# EAGLE design pidshield-mk-2.1 (EAGLE 6.5.0)
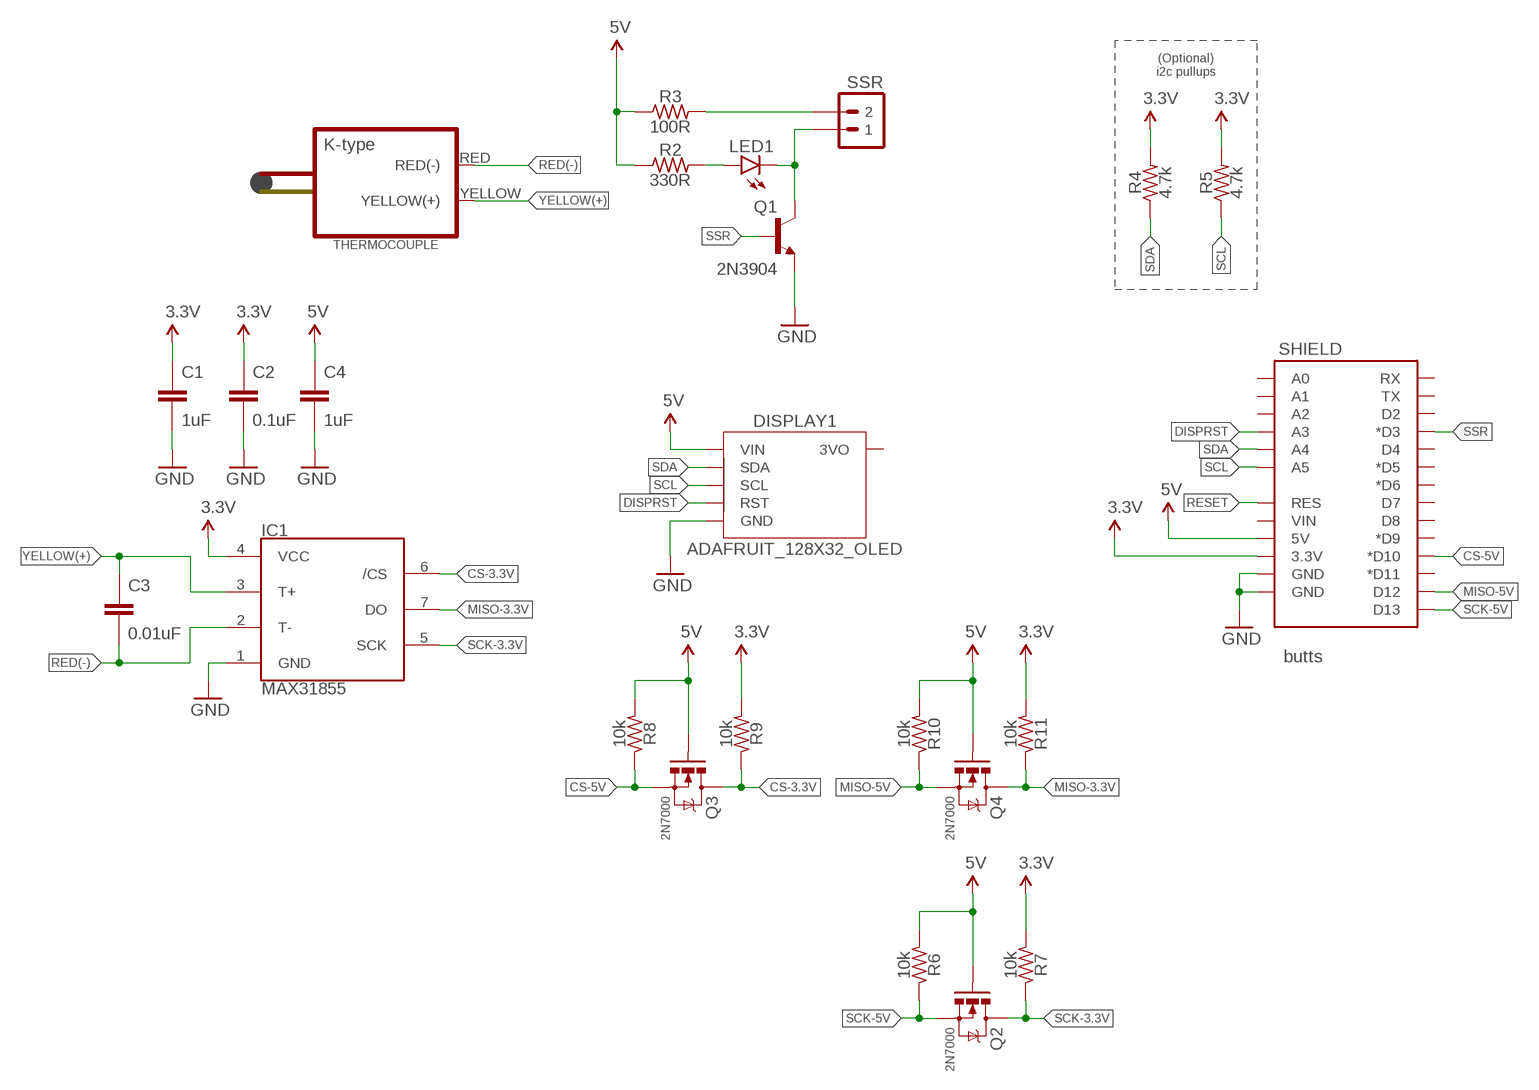
[diagram p0: schematic, sheet 1]

## Parts
C1  1uF  CAPACITOR-CERAMIC025-024X044  [C025-024X044]
C2  0.1uF  CAPACITOR-CERAMIC025-024X044  [C025-024X044]
C3  0.01uF  CAPACITOR-CERAMICC0805  [C0805]
C4  1uF  CAPACITOR-CERAMIC025-024X044  [C025-024X044]
DISPLAY1  ADAFRUIT_128X32_OLED  ADAFRUIT_128X32_OLED_I2CNOSILK_NOHOLES_NOPROBLEM  [ADAFRUIT_128X32_OLED_I2C_CLOSER_NS]
IC1  MAX31855  MAX31855SOIC  [SOIC127P600X175-8N]
LED1  LED3MM-LESS  [LED3MM-LESSSILK]
Q1  2N3904  TRANSISTOR_NPNTO-92-AMMO-EBC  [TO-92-AMMO]
Q2  2N7000  MOSFET-NCHANNEL2N7000-AMMO  [TO-92-AMMO]
Q3  2N7000  MOSFET-NCHANNEL2N7000-AMMO  [TO-92-AMMO]
Q4  2N7000  MOSFET-NCHANNEL2N7000-AMMO  [TO-92-AMMO]
R2  330R  RESISTORPTH-AXIAL-5.08MM  [RESISTOR-AXIAL-PTH-5.08MM]
R3  100R  RESISTORPTH-AXIAL-5.08MM  [RESISTOR-AXIAL-PTH-5.08MM]
R4  4.7k  RESISTORPTH-AXIAL-5.08MM  [RESISTOR-AXIAL-PTH-5.08MM]
R5  4.7k  RESISTORPTH-AXIAL-5.08MM  [RESISTOR-AXIAL-PTH-5.08MM]
R6  10k  RESISTORPTH-AXIAL-5.08MM  [RESISTOR-AXIAL-PTH-5.08MM]
R7  10k  RESISTORPTH-AXIAL-5.08MM  [RESISTOR-AXIAL-PTH-5.08MM]
R8  10k  RESISTORPTH-AXIAL-5.08MM  [RESISTOR-AXIAL-PTH-5.08MM]
R9  10k  RESISTORPTH-AXIAL-5.08MM  [RESISTOR-AXIAL-PTH-5.08MM]
R10  10k  RESISTORPTH-AXIAL-5.08MM  [RESISTOR-AXIAL-PTH-5.08MM]
R11  10k  RESISTORPTH-AXIAL-5.08MM  [RESISTOR-AXIAL-PTH-5.08MM]
SHIELD  butts  ARDUINO_SHIELD_SMALLER  [ARDUINO_SHIELD_NOOUTLINE_INSIDE_SMALLER]
SSR  M02JST-PTH-RA-SMALLPADS  [JST-2-PH-RA-PTH-SMALLPADS]
THERMOCOUPLE  THERMOCOUPLE-CONNECTORMINI-PCB  [PCC-SMP]

## Nets
3.3V: C1.1 C2.1 IC1.4(VCC) R4.P$2 R5.P$2 R7.P$2 R9.P$2 R11.P$2 SHIELD.3.3V
5V: C4.1 DISPLAY1.VIN Q2.2(G) Q3.2(G) Q4.2(G) R2.P$1 R3.P$1 R6.P$2 R8.P$2 R10.P$2 SHIELD.5V
CS-3.3V: IC1.6(/CS) Q3.3(D) R9.P$1
CS-5V: Q3.1(S) R8.P$1 SHIELD.D10(*D10)
DISPRST: DISPLAY1.RST SHIELD.A3
GND: C1.2 C2.2 C4.2 DISPLAY1.GND IC1.1(GND) Q1.1(E) SHIELD.GND@0(GND) SHIELD.GND@1(GND)
MISO-3.3V: IC1.7(DO) Q4.3(D) R11.P$1
MISO-5V: Q4.1(S) R10.P$1 SHIELD.D12
N$2: LED1.A R2.P$2
N$3: LED1.K(C) Q1.3(C) SSR.1
N$4: R3.P$2 SSR.2
RED(-): C3.2 IC1.2(T-) THERMOCOUPLE.RED(RED(-))
RESET: SHIELD.RES
SCK-3.3V: IC1.5(SCK) Q2.3(D) R7.P$1
SCK-5V: Q2.1(S) R6.P$1 SHIELD.D13
SCL: DISPLAY1.SCL R5.P$1 SHIELD.A5
SDA: DISPLAY1.SDA R4.P$1 SHIELD.A4
SSR: Q1.2(B) SHIELD.D3(*D3)
YELLOW(+): C3.1 IC1.3(T+) THERMOCOUPLE.YELLOW(YELLOW(+))
Unconnected: DISPLAY1.3VO SHIELD.A0 SHIELD.A1 SHIELD.A2 SHIELD.D2 SHIELD.D4 SHIELD.D5(*D5) SHIELD.D6(*D6) SHIELD.D7 SHIELD.D8 SHIELD.D9(*D9) SHIELD.D11(*D11) SHIELD.RX SHIELD.TX SHIELD.VIN

## Notes on the sheet
- (Optional)
  i2c pullups

## Library data of the parts
C1-C4 = A_butts:CAPACITOR-CERAMIC: CAPACITOR, European symbol
DISPLAY1 = A_butts:ADAFRUIT_128X32_OLED_I2C
IC1 = A_butts:MAX31855
LED1 = A_butts:LED: LEDs Standard schematic elements and footprints for 5mm, 3mm, 1206, and 0603 sized LEDs. 5mm - Spark Fun Electronics SKU : COM-00529 (and others)
Q1 = A_butts:TRANSISTOR_NPN: Generic NPN BJT MMBT2222A - TRANS-08049 (SOT-23, 1A 40V) MPSA42 - TRANS-09116 (SOT-23, 500mA 300V) MMBT5088LT1G - TRANS-11160 (SOT-23, 50 mA 30V) BC547 - COM-08928 <http://www.sparkfun.com/products/8928> (TO-92 45V 100mA) (1.Collector 2.Base 3.Emitter) 2N3904 - COM-00521 <http://www.sparkfun.com/products/521> (TO-92 40V 200mA) (1.Emitter 2.Base 3.Collector) P2N2222A - COM-12852 <http://www.sparkfun.com/products/12852> (TO-92 40V 600mA) (1.Collector 2.Base 3.Emitter)
Q2-Q4 = A_butts:MOSFET-NCHANNEL: Common NMOSFET Parts MFG P/N Store ID Prod ID FDD8780 TRANS-09984 SI7820DN TRANS-11055 FDS6630A IC-08089 2N7002PW TRANS-11151 FQP30N06L COM-10213 TRANS-10060 BSS123LT1G TRANS-08345 BSS138 TRANS-00830 BS170 2N7000
R2-R11 = A_butts:RESISTOR: RESISTOR, American symbol
SHIELD = A_butts:ARDUINO_SHIELD_SMALLER
SSR = A_butts:M02: Standard 2-pin 0.1" header. Use with - straight break away headers ( PRT-00116) - right angle break away headers (PRT-00553) - swiss pins (PRT-00743) - machine pins (PRT-00117) - female headers (PRT-00115) Molex polarized connector foot print use with: PRT-08233 with associated crimp pins and housings. 2.54_SCREWTERM for use with PRT-10571. 3.5mm Screw Terminal footprints for PRT-08084 5mm Screw Terminal footprints for use with PRT-08433
THERMOCOUPLE = A_butts:THERMOCOUPLE-CONNECTOR

## Board
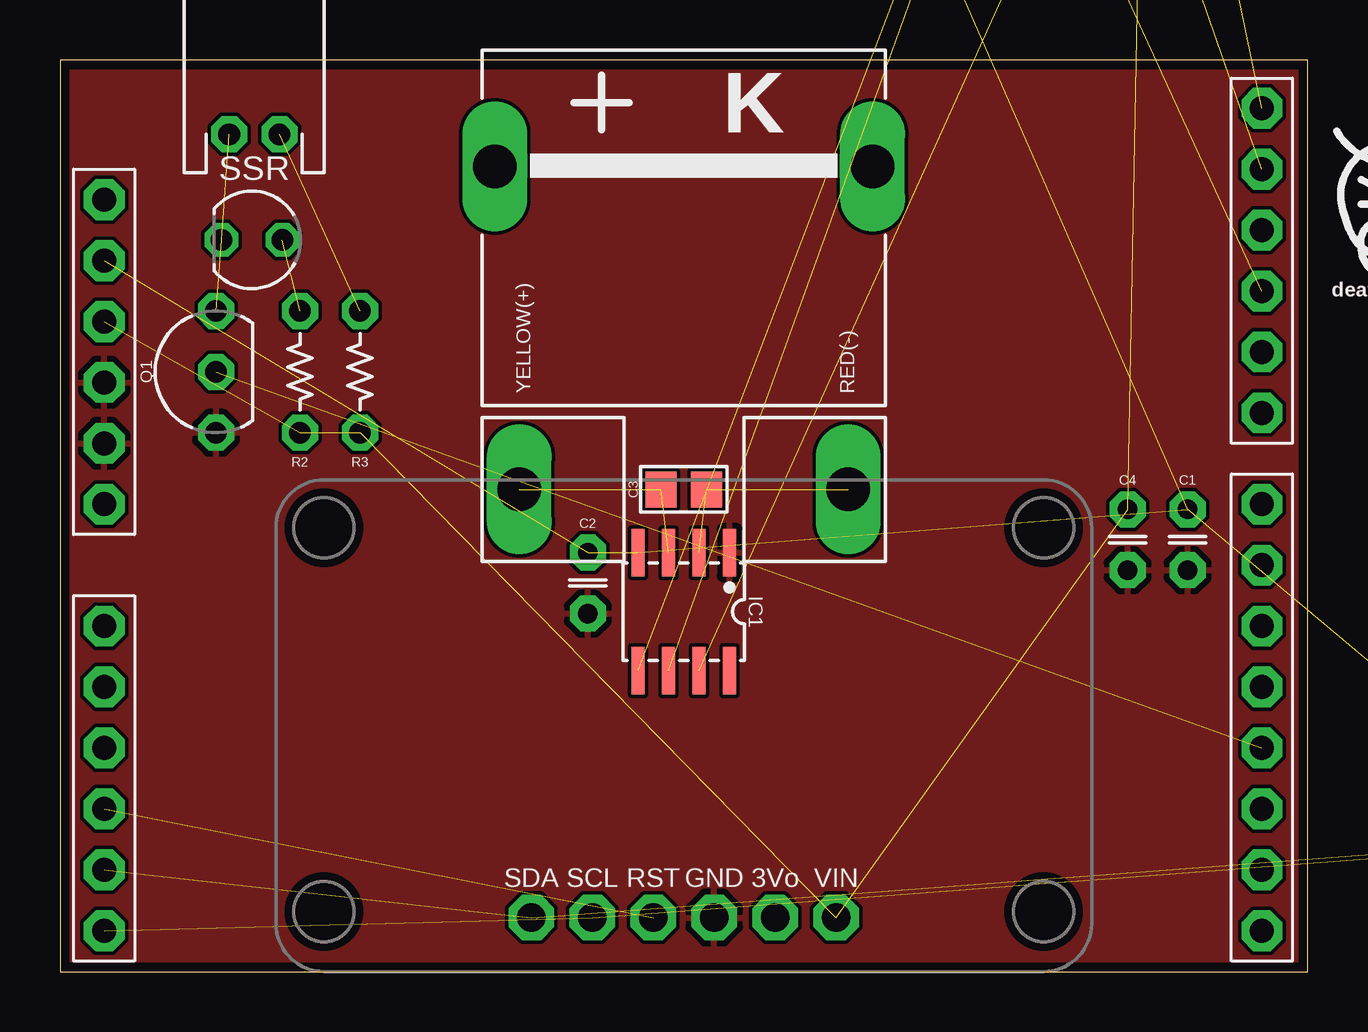
[diagram p1: board, top side]
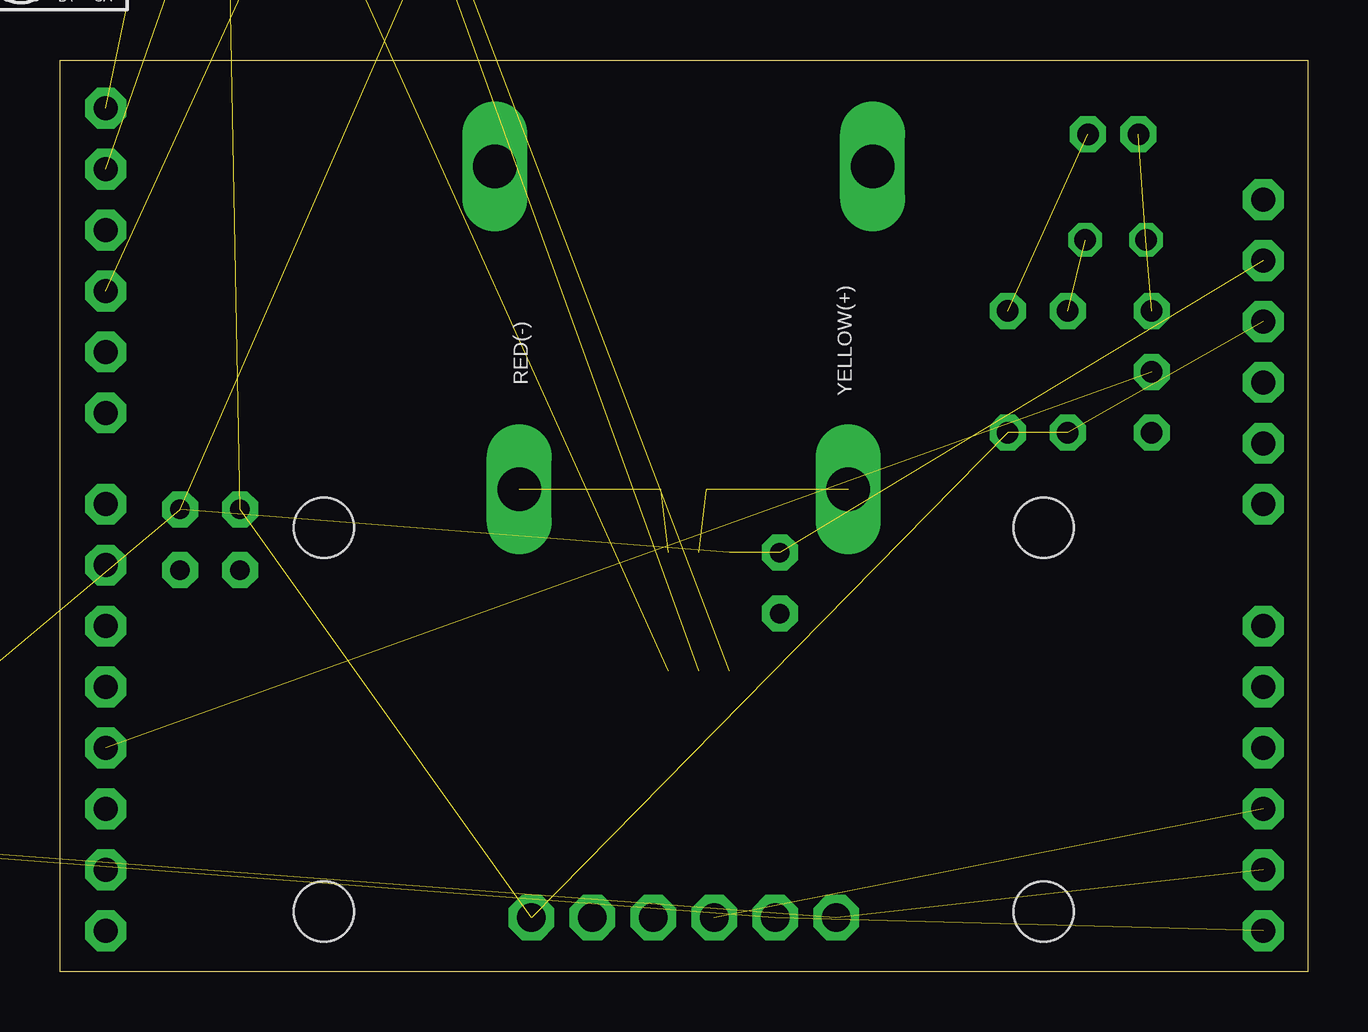
[diagram p2: board, bottom side, seen from below]

Size 52 x 38 mm. Coordinates in mm from the lower left corner, seen from the top.
Outline: 0,38 0,0 52,0 52,38 0,38
Copper layers (1*16): Top 0.0356mm / dielectric 1.5011mm / Bottom 0.0356mm
Design rules "LaenPCBOrder2": minimum track width 6mil, minimum drill 13mil, track to track 6mil, track to pad 6mil, pad to pad 6mil, via to via 6mil, smd to smd 6mil, copper to edge 15mil, drill to drill 6mil, minimum pad ring 7mil, minimum via ring 7mil, stop-mask expansion 3mil, vias tented up to drill 20mil, thermal gap 10mil
Holes 2.5 mm at 11,2.5 11,18.5 41,18.5 41,2.5

### Footprints (pad centres in the part's own frame; a part is rotated, then mirrored left to right if it is on the bottom)
C025-024X044 = drill 0.813 pad 1.5 octagon: 1 -1.27,0; 2 1.27,0
C0805 = smd 1.3 x 1.5: 1 -0.95,0; 2 0.95,0
ADAFRUIT_128X32_OLED_I2C_CLOSER_NS = drill 1.2 pad 1.9 octagon: 3VO 3.81,0; GND 1.27,0; RST -1.27,0; SCL -3.81,0; SDA -6.35,0; VIN 6.35,0
SOIC127P600X175-8N = smd 1.981 x 0.559: 1 -2.464,1.905; 2 -2.464,0.635; 3 -2.464,-0.635; 4 -2.464,-1.905; 5 2.464,-1.905; 6 2.464,-0.635; 7 2.464,0.635; 8 2.464,1.905
LED3MM-LESSSILK = drill 0.9 pad 1.4 octagon: A -1.27,0; K 1.27,0
TO-92-AMMO = drill 0.9 pad 1.5 octagon: 1 -2.54,0; 2 0,0; 3 2.54,0
RESISTOR-AXIAL-PTH-5.08MM = drill 0.9 pad 1.5 octagon: P$1 -2.54,0; P$2 2.54,0
ARDUINO_SHIELD_NOOUTLINE_INSIDE_SMALLER = drill 1 pad 1.7 octagon: 3.3V 48.26,-27.94; 5V 48.26,-25.4; A0 48.26,-12.7; A1 48.26,-10.16; A2 48.26,-7.62; A3 48.26,-5.08; A4 48.26,-2.54; A5 48.26,0; D2 0,-5.08; D3 0,-7.62; D4 0,-10.16; D5 0,-12.7; D6 0,-15.24; D7 0,-17.78; D8 0,-21.59; D9 0,-24.13; D10 0,-26.67; D11 0,-29.21; D12 0,-31.75; D13 0,-34.29; GND@0 48.26,-22.86; GND@1 48.26,-20.32; RES 48.26,-30.48; RX 0,0; TX 0,-2.54; VIN 48.26,-17.78
JST-2-PH-RA-PTH-SMALLPADS = drill 0.9 pad 1.5 octagon: 1 -1.05,0; 2 1.05,0
PCC-SMP = drill 1.8 long: P$1 13.462,-7.874; P$2 13.462,7.874; RED 0,-6.858; YELLOW 0,6.858

### Placement (x,y rotation side)
C1  47,18 270 top
C2  22,16.19 270 top
C3  26,20.1 0 top
C4  44.5,18 270 top
DISPLAY1  26,2.25 0 top
IC1  26,15 270 top
LED1  8,30.5 180 top
Q1  6.5,25 90 top
Q2  45,58 270 top  (outside the outline)
Q3  36,52 90 top  (outside the outline)
Q4  45,45.5 270 top  (outside the outline)
R2  10,25 90 top
R3  12.5,25 90 top
R4  69,8.5 90 top  (outside the outline)
R5  58,7.5 90 top  (outside the outline)
R6  38.5,59.5 180 top  (outside the outline)
R7  38.5,57 180 top  (outside the outline)
R8  42.5,50.5 0 top  (outside the outline)
R9  42.5,53 0 top  (outside the outline)
R10  38.5,47 180 top  (outside the outline)
R11  38.5,44.5 180 top  (outside the outline)
SHIELD  50.1,1.7 180 top
SSR  8.1,34.9 0 top
THERMOCOUPLE  26,20.1 90 top
U$2  [COW]  82.5,28 0 bottom  (outside the outline)
U$3  [COW_SMALL]  55.5,32.5 0 top  (outside the outline)
U$4  [CC-BY-SA-4.0-NO-URL]  59.5,41.5 0 top  (outside the outline)
U$5  [CC-BY-SA-4.0-NO-URL]  52,41.5 0 bottom  (outside the outline)
U$6  [OSHWLOGO_TOP_0.2_A]  71,33.5 0 top  (outside the outline)
U$7  [OSHWLOGO_BOT_0.2_A]  66.5,33.5 0 top  (outside the outline)

### Tracks (layer width: path | path; a pad name or v marks a point on that pad's centre or on a via)
3.3V  (8 unrouted)
5V  (10 unrouted)
CS-3.3V  (2 unrouted)
CS-5V  (2 unrouted)
DISPRST  (1 unrouted)
GND
  pour Top: -0.1,-0.1 -0.1,38.1 52.1,38.1 52.1,-0.1
MISO-3.3V  (2 unrouted)
MISO-5V  (2 unrouted)
N$2  (1 unrouted)
N$3  (2 unrouted)
N$4  (1 unrouted)
RED(-)  (2 unrouted)
SCK-3.3V  (2 unrouted)
SCK-5V  (2 unrouted)
SCL  (2 unrouted)
SDA  (2 unrouted)
SSR  (1 unrouted)
YELLOW(+)  (2 unrouted)

### Text on the board
tPlace: P.I.D. Shield MK 2.0
bPlace: P.I.D. Shield MK 2.0